# EAGLE design RasPi-BplusHAT (EAGLE 7.5.0)

## Sheet 1 of 2
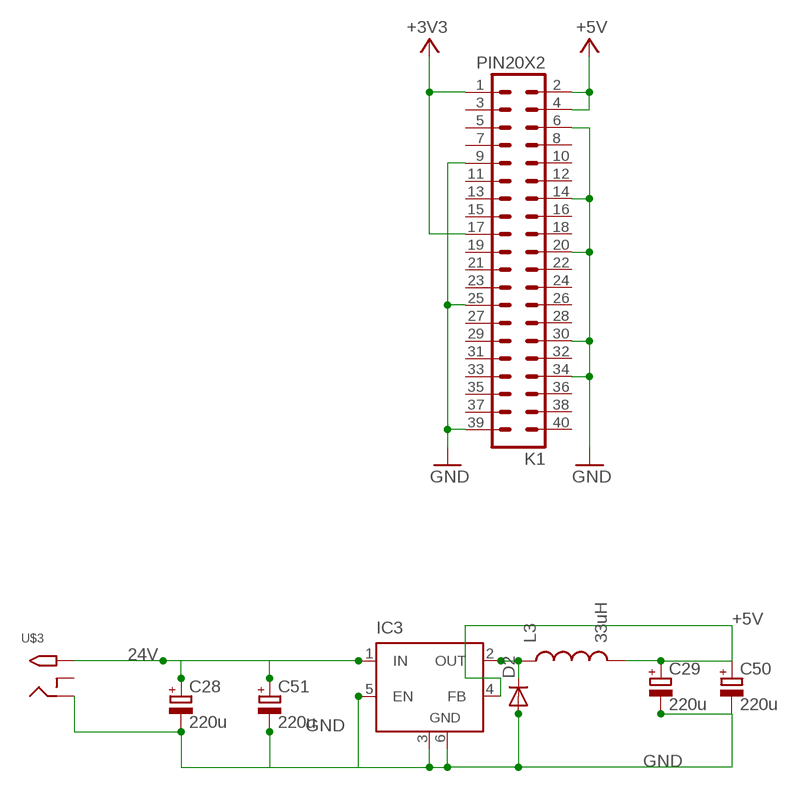
[diagram p0: schematic, sheet 1]

### Parts
C28  220u  CPOL-EUE2.5-7  [E2,5-7]
C29  220u  CPOL-EUE2.5-7  [E2,5-7]
C50  220u  CPOL-EUD  [PANASONIC_D]
C51  220u  CPOL-EUD  [PANASONIC_D]
D2  DIODE-DO-214AC  [DO-214AC]
IC3  LM2596S  [TO263-5]
K1  PIN20X2  [PIN_20X2]
L3  33uH  INDUCTORPWR  [CDRH125]
U$3  2.1MMJACKTHM  [PJ-102A]

### Nets
24V: C28.+ C51.+ IC3.1(IN) U$3.TIP
+3V3: K1.1 K1.17
+5V: C29.+ C50.+ IC3.4(FB) K1.2 K1.4 L3.2
GND: C28.- C29.- C50.- C51.- D2.2(A) IC3.3(GND) IC3.5(EN) IC3.6(GND) K1.6 K1.9 K1.14 K1.20 K1.25 K1.30 K1.34 K1.39 U$3.RING
N$50: D2.1(C) IC3.2(OUT) L3.1
Unconnected: K1.3 K1.5 K1.7 K1.8 K1.10 K1.11 K1.12 K1.13 K1.15 K1.16 K1.18 K1.19 K1.21 K1.22 K1.23 K1.24 K1.26 K1.27 K1.28 K1.29 K1.31 K1.32 K1.33 K1.35 K1.36 K1.37 K1.38 K1.40 U$3.RING_SW

## Sheet 2 of 2
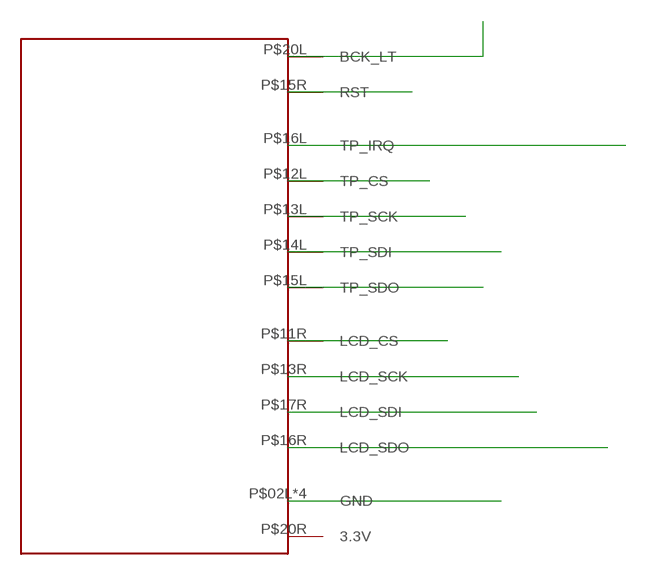
[diagram p1: schematic, sheet 2]

### Parts
U$1  HY28BSTD  [HY28B]

### Nets
N$1: U$1.P$15L(TP_SDO)
N$2: U$1.P$02L(GND) U$1.P$02R(GND) U$1.P$19L(GND) U$1.P$19R(GND)
N$3: U$1.P$16R(LCD_SDO)
N$4: U$1.P$17R(LCD_SDI)
N$5: U$1.P$13R(LCD_SCK)
N$6: U$1.P$11R(LCD_CS)
N$7: U$1.P$12L(TP_CS)
N$8: U$1.P$16L(TP_IRQ)
N$9: U$1.P$14L(TP_SDI)
N$10: U$1.P$15R(RST)
N$11: U$1.P$13L(TP_SCK)
N$14: U$1.P$20L(BCK_LT)
Unconnected: U$1.P$20R(3.3V)

## Library data of the parts
C28 C29 C50 C51 = rcl:CPOL-EU: POLARIZED CAPACITOR, European symbol
D2 = dp_devices:DIODE: Various Diode Packages
IC3 = linear:LM2596S: STEP-DOWN VOLTAGE REGULATOR
K1 = FLYFISH:PIN20X2
L3 = SparkFun-Passives:INDUCTOR: Inductors Basic Inductor/Choke - 0603 and 1206. Footprints are not proven and vary greatly between part numbers. SRN6045- 33uH, 20% 1.4A SDR0403-560KL - 56uH, 10%, 500mA RMS/740mA peak
U$1 = hy28b:HY28B
U$3 = adafruit:2.1MMJACK: 2.1mm x 5.5mm THM DC jack with internal switch. Digikey part #PJ-102A, 4UCON part #05537 2.1mm x 5.5mm SMT DC jack with internal switch. Digikey part #PJ-002A-SMT, 4UCON part #03267 By microbuilder.eu & adafruit.com

## Board
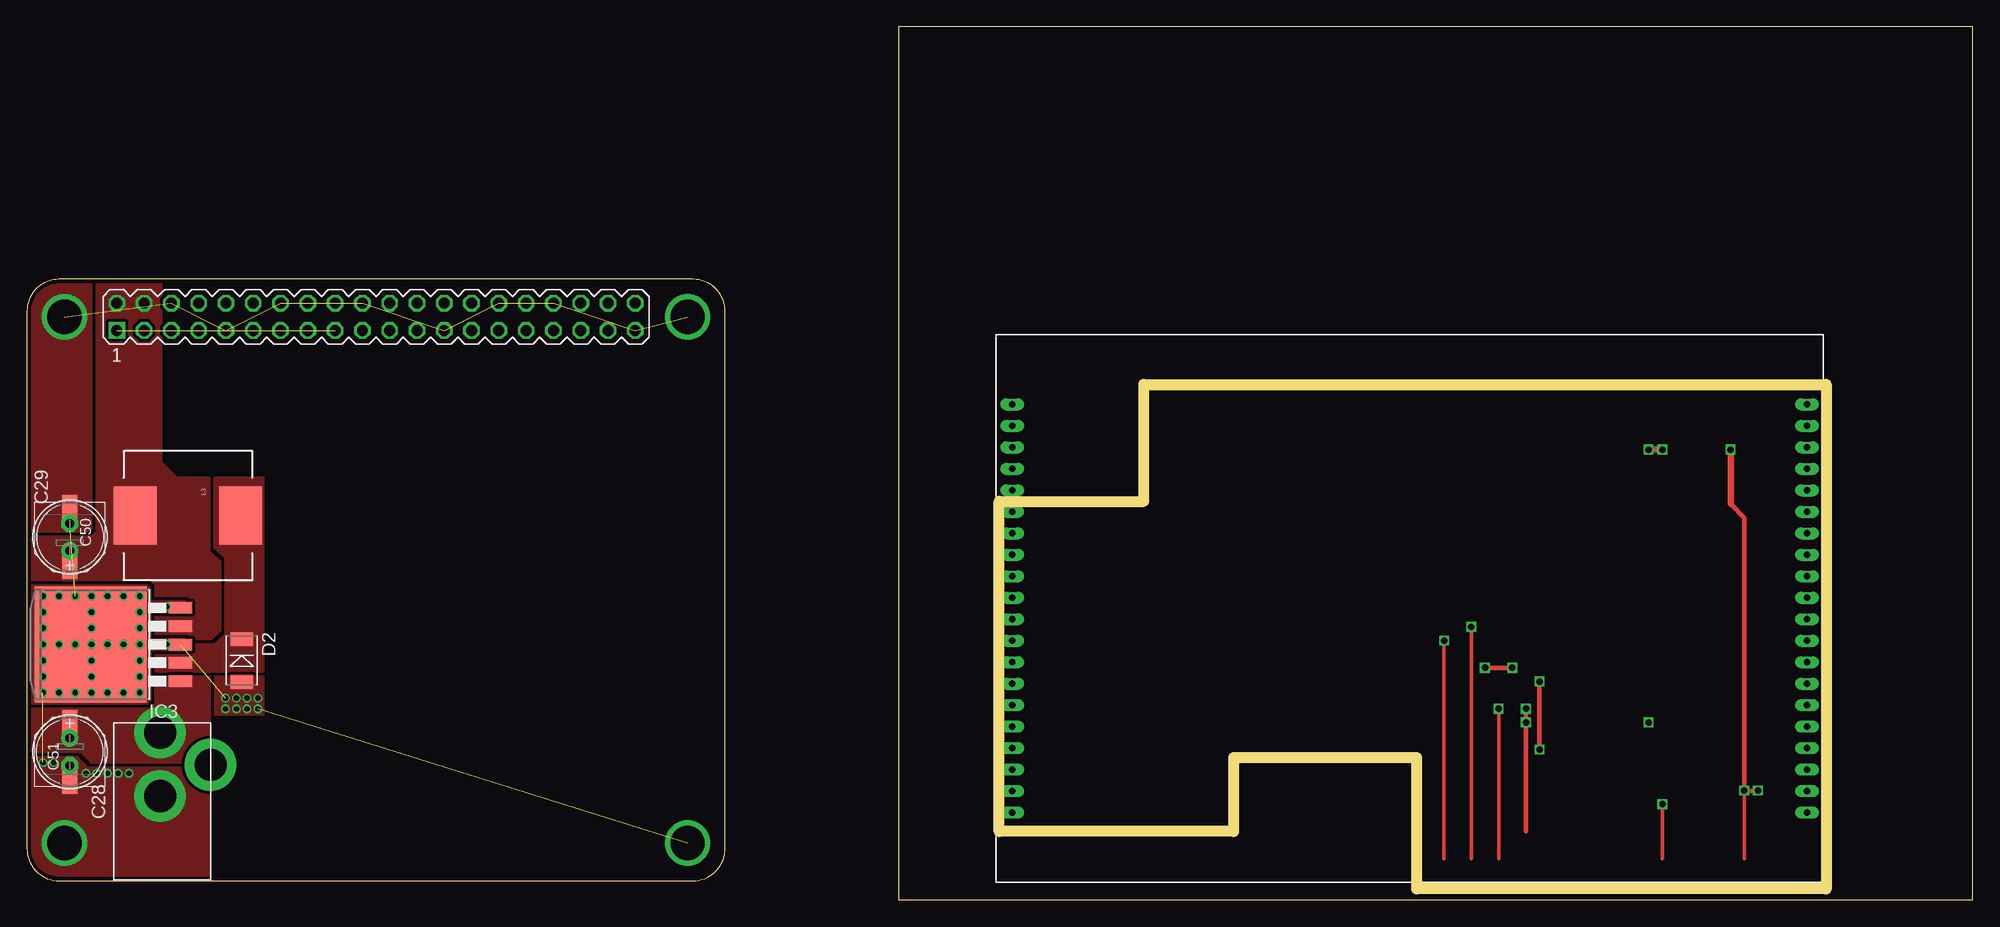
[diagram p2: board, top side]
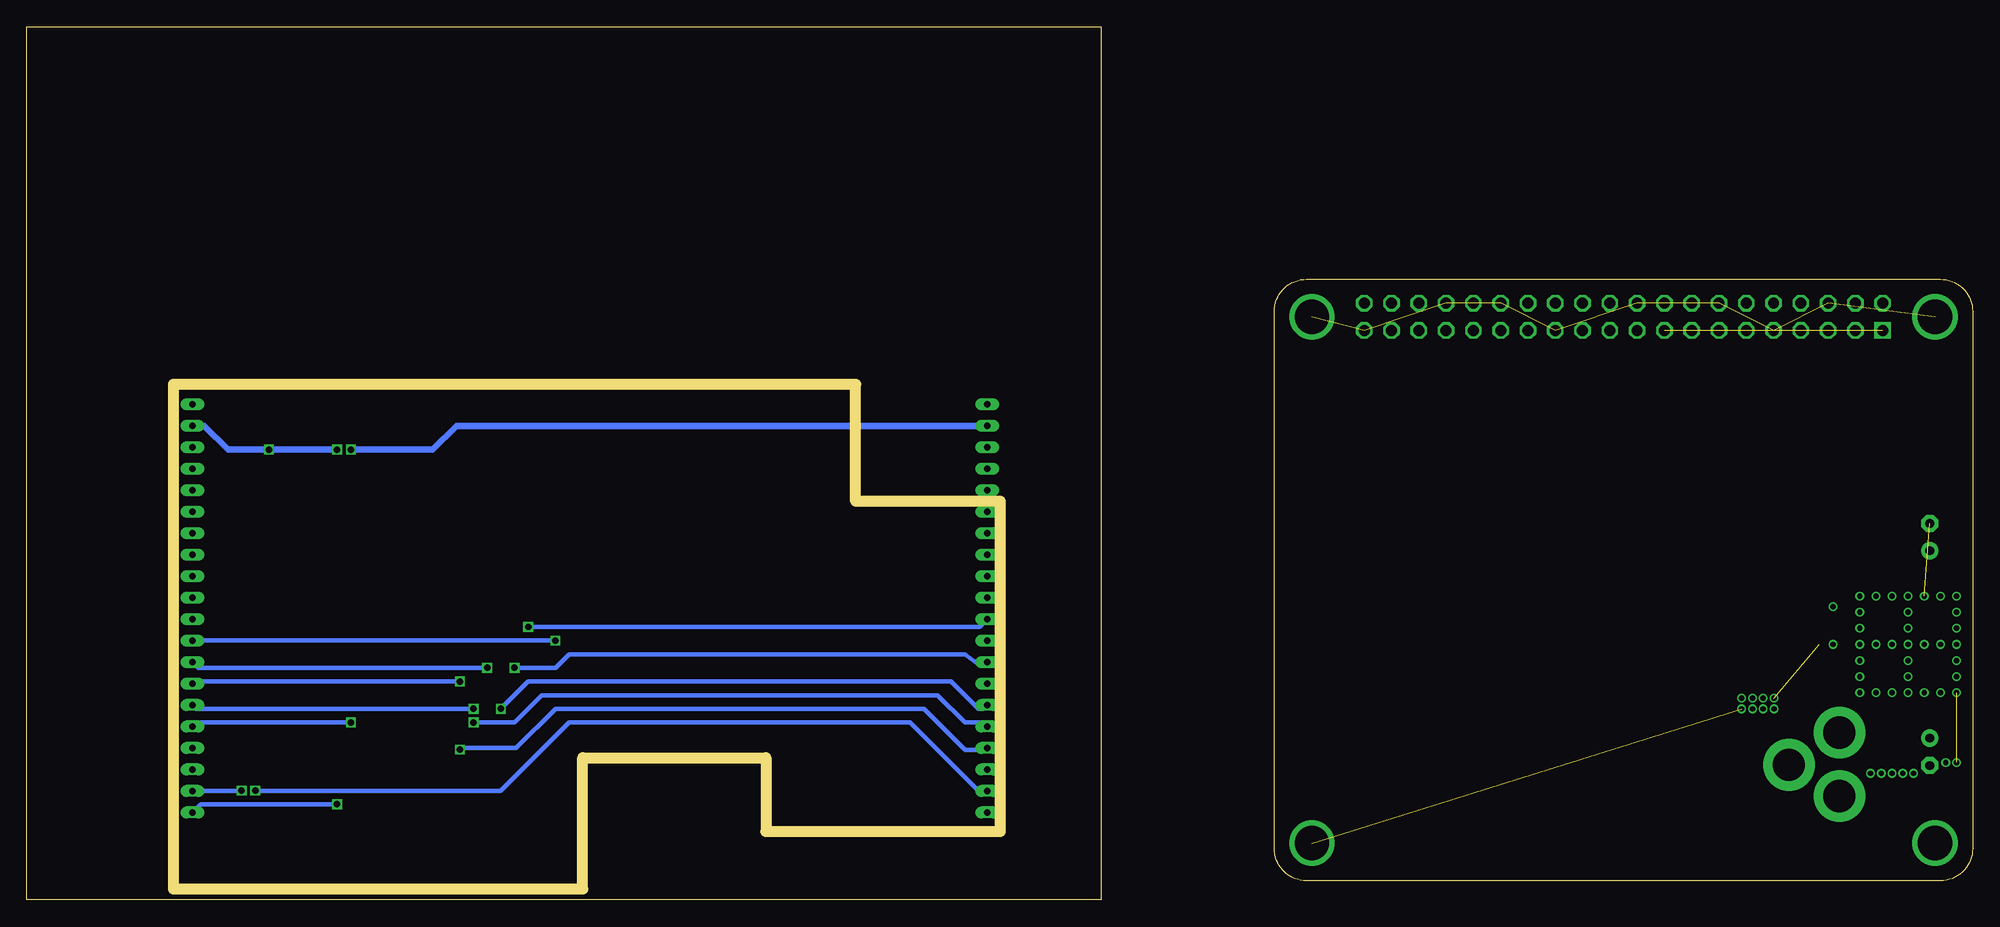
[diagram p3: board, bottom side, seen from below]

Size 181.11 x 81.27 mm. Coordinates in mm from the lower left corner, seen from the top.
Outline: 0,4.77 arc90 3,1.77 62,1.77 arc90 65,4.77 65,54.77 arc90 62,57.77 3,57.77 arc90 0,54.77 0,4.77
Outline: 81.11,0 181.11,0 181.11,81.27 81.11,81.27 81.11,0
Copper layers (1*16): Top 0.035mm / dielectric 1.5mm / Bottom 0.035mm
Design rules "ITEADstudio_DRC": minimum track width 6mil, minimum drill 12mil, track to track 6mil, track to pad 6mil, pad to pad 6mil, via to via 6mil, smd to smd 0mil, copper to edge 10mil, drill to drill 10mil, minimum pad ring 10mil, minimum via ring 6mil, stop-mask expansion 2mil, vias tented up to drill 100mil, thermal gap 10mil
Milling: 10 lines

### Footprints (pad centres in the part's own frame; a part is rotated, then mirrored left to right if it is on the bottom)
E2,5-7 = drill 0.813 pad 1.6: + -1.27,0 | drill 0.813 pad 1.6 octagon: - 1.27,0
PANASONIC_D = smd 3 x 1.4: + 2.4,0; - -2.4,0
DO-214AC = smd 1.27 x 2.1: 1 -1.98,0; 2 1.98,0
TO263-5 = smd 1.067 x 2.159: 1 -3.404,-5.791; 2 -1.702,-5.791; 3 0,-5.791; 4 1.702,-5.791; 5 3.404,-5.791 | smd 10.8 x 10.41: 6 0,2.54
PIN_20X2 = drill 1.016 square: 1 -24.13,-1.27 | drill 1.016 octagon: 2 -24.13,1.27; 3 -21.59,-1.27; 4 -21.59,1.27; 5 -19.05,-1.27; 6 -19.05,1.27; 7 -16.51,-1.27; 8 -16.51,1.27; 9 -13.97,-1.27; 10 -13.97,1.27; 11 -11.43,-1.27; 12 -11.43,1.27; 13 -8.89,-1.27; 14 -8.89,1.27; 15 -6.35,-1.27; 16 -6.35,1.27; 17 -3.81,-1.27; 18 -3.81,1.27; 19 -1.27,-1.27; 20 -1.27,1.27; 21 1.27,-1.27; 22 1.27,1.27; 23 3.81,-1.27; 24 3.81,1.27; 25 6.35,-1.27; 26 6.35,1.27; 27 8.89,-1.27; 28 8.89,1.27; 29 11.43,-1.27; 30 11.43,1.27; 31 13.97,-1.27; 32 13.97,1.27; 33 16.51,-1.27; 34 16.51,1.27; 35 19.05,-1.27; 36 19.05,1.27; 37 21.59,-1.27; 38 21.59,1.27; 39 24.13,-1.27; 40 24.13,1.27
CDRH125 = smd 5.4 x 4: 1 0,4.9; 2 0,-4.9
HY28B = drill 0.6 long: P$01L 74,38; P$01R 0,38; P$02L 74,36; P$02R 0,36; P$03L 74,34; P$03R 0,34; P$04L 74,32; P$04R 0,32; P$05L 74,30; P$05R 0,30; P$06L 74,28; P$06R 0,28; P$07L 74,26; P$07R 0,26; P$08L 74,24; P$08R 0,24; P$09L 74,22; P$09R 0,22; P$10L 74,20; P$10R 0,20; P$11L 74,18; P$11R 0,18; P$12L 74,16; P$12R 0,16; P$13L 74,14; P$13R 0,14; P$14L 74,12; P$14R 0,12; P$15L 74,10; P$15R 0,10; P$16L 74,8; P$16R 0,8; P$17L 74,6; P$17R 0,6; P$18L 74,4; P$18R 0,4; P$19L 74,2; P$19R 0,2; P$20L 74,0; P$20R 0,0
PJ-102A = drill 3 pad 4.8: RING 0.1,-3.39; RING_SW -4.6,-6.29; TIP 0.1,-9.29

### Placement (x,y rotation side)
C28  4,13.77 270 top
C29  4,33.77 90 top
C50  4,33.77 270 top
C51  4,13.77 90 top
D2  20,22.27 270 top
IC3  8.5,23.77 90 top
K1  32.5,54.27 0 top
L3  15,35.77 270 top
U$1  91.71,8.12 0 top
U$3  12.5,6.27 180 top

### Tracks (layer width: path | path; a pad name or v marks a point on that pad's centre or on a via)
24V
  pour Top (isolate 0.305, rank 3, no thermals): 0.5,17.77 11.5,17.77 12,18.27 12,20.77 17,20.77 17,12.77 6,12.77 5,13.77 0.5,13.77
+3V3  (1 unrouted)
+5V
  pour Top (isolate 0.305, rank 2, no thermals): 12,24.77 15,24.77 15.5,24.27 17.5,24.27 18,24.77 18,31.77 17,32.77 17,39.27 14,39.27 12.5,40.77 12.5,57.27 6.5,57.27 6.5,34.27 6,33.77 0.5,33.77 0.5,29.77 11.5,29.77 12,29.27 12,28.27 15,28.27 15.5,27.77 15.5,26.27 12,26.27
GND  (via drill 0.5, 3.2 pad 3.81)  (13 unrouted)
  other vias: 19.5,18.77 20.5,18.77 21.5,18.77 21.5,17.77 20.5,17.77 19.5,17.77 18.5,17.77 18.5,18.77 9.5,11.77 8.5,11.77 7.5,11.77 6.5,11.77 5.5,11.77 2.5,12.77 1.5,12.77 10.5,19.27 13,23.77 13,27.27 10.5,20.77 10.5,22.27 10.5,23.77 10.5,25.27 10.5,26.77 10.5,28.27 9,28.27 7.5,28.27 6,28.27 4.5,28.27 3,28.27 1.5,28.27 1.5,26.77 1.5,25.27 1.5,23.77 1.5,22.27 1.5,20.77 1.5,19.27 3,19.27 4.5,19.27 6,19.27 7.5,19.27 9,19.27 6,23.77 4.5,23.77 7.5,23.77 6,25.27 6,22.27 6,20.77 6,26.77 3,23.77 9,23.77 3.5,54.27 61.5,54.27 61.5,5.27 3.5,5.27
  pour Top (isolate 0.305, rank 6, no thermals): 0.5,13.27 5,13.27 6,12.27 17,12.27 17,2.27 3,2.27 arc-90 0.5,4.77
  pour Top (isolate 0.305, rank 6, no thermals): 17.5,20.77 22,20.77 22,17.27 17.5,17.27
  pour Top (isolate 0.305, rank 6, no thermals): 0.5,29.27 11.5,29.27 11.5,27.77 15.5,27.77 15.5,26.77 11.5,26.77 11.5,24.27 15.5,24.27 15.5,23.27 11.5,23.27 11.5,18.27 0.5,18.27
  pour Top (isolate 0.305, rank 6, no thermals): 0.5,34.27 5.5,34.27 arc90 6,34.77 6,57.27 3,57.27 arc90 0.5,54.77
N$1
  Top 0.406: 165.37,17.78 U$1.P$15L
N$2  (via drill 0.6)
  Top 0.305: v159.85,10.16 159.85,3.81
  Top 0.406: v161.12,10.16 v159.85,10.16 159.85,35.56 158.58,36.83
  Top 0.61: v158.58,41.91 158.58,36.83 | v150.96,41.91 v152.23,41.91
  Bottom 0.406: v159.85,10.16 157.27,10.12 137.03,10.12 130.64,16.51 98.89,16.51 92.54,10.16 91.75,10.16 U$1.P$19R | v161.12,10.16 165.67,10.16 U$1.P$19L 165.75,10.16
  Bottom 0.61: U$1.P$02R 141.13,44.12 143.34,41.91 v150.96,41.91 | U$1.P$02L 164.6,44.12 162.39,41.91 v158.58,41.91 v152.23,41.91
N$3  (via drill 0.6)
  Top 0.406: v139.53,17.78 v139.53,16.51 139.53,6.35
  Bottom 0.406: v139.53,17.78 165.37,17.78 | v139.53,16.51 135.72,16.51 133.18,19.05 96.35,19.05 93.81,16.51 92.1,16.51 U$1.P$16R
N$4  (via drill 0.6)
  Top 0.406: v140.8,13.97 v140.8,20.32
  Bottom 0.406: v140.8,20.32 165.51,20.32 | v140.8,13.97 140.65,14.12 135.57,14.12 131.91,17.78 97.62,17.78 93.81,13.97 91.86,13.97 U$1.P$17R
N$5  (via drill 0.6)
  Top 0.406: v135.72,21.59 v138.26,21.59
  Bottom 0.406: v138.26,21.59 165.18,21.59 | v135.72,21.59 131.91,21.59 130.64,22.86 93.81,22.86 92.54,21.89 91.94,21.89 U$1.P$13R
N$6  (via drill 0.6)
  Top 0.305: v134.45,25.4 134.45,3.81
  Bottom 0.406: v134.45,25.4 92.43,25.4 U$1.P$11R
N$7  (via drill 0.6)
  Top 0.305: v131.91,24.13 131.91,3.81
  Bottom 0.406: v131.91,24.13 U$1.P$12L
N$8  (via drill 0.6)
  Bottom 0.406: v150.96,16.51 165.32,16.51 U$1.P$16L
N$10  (via drill 0.6)
  Top 0.305: v136.99,17.78 136.99,3.81
  Bottom 0.406: v136.99,17.78 134.45,20.32 95.08,20.32 92.54,17.78 92.05,17.78 U$1.P$15R
N$14  (via drill 0.6)
  Top 0.305: v152.23,8.89 152.23,3.81
  Bottom 0.406: v152.23,8.89 164.94,8.89 U$1.P$20L
N$50
  pour Top (isolate 0.305, no thermals): 17.5,39.27 17.5,32.77 18.5,31.77 18.5,24.77 17.5,23.77 15.5,23.77 15.5,22.77 12,22.77 12,21.27 22,21.27 22,39.27